# EAGLE design v1 (EAGLE 9.5.2)
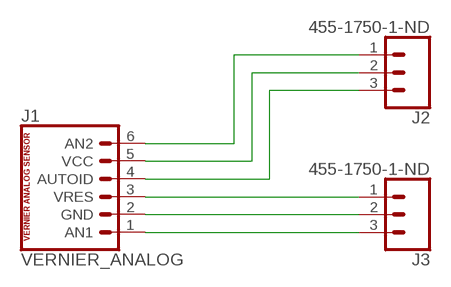
[diagram p0: schematic, sheet 1]

## Parts
J1  VERNIER_ANALOG  [BTA]
J2  455-1750-1-ND  CONN_03  [1X03]
J3  455-1750-1-ND  CONN_03  [1X03]

## Nets
N$1: J1.1(AN1) J3.3
N$2: J1.2(GND) J3.2
N$3: J1.3(VRES) J3.1
N$4: J1.4(AUTOID) J2.3
N$5: J1.5(VCC) J2.2
N$6: J1.6(AN2) J2.1

## Library data of the parts
J1 = SparkFun-Connectors:VERNIER_ANALOG: British Telecom Connector - BTA (female) This device is useful when designing a project that uses any of the analog sensors in the Vernier ecosystem (sensors and/or controllers) SparkFun Products: SparkFun Vernier Interface Shield <https://www.sparkfun.com/products/12858> (DEV-12858) British Telecom Connector - BTA (female) <https://www.sparkfun.com/products/12753>; PROD_ID: CONN-11653; SF_ID: PRT-12753
J2 J3 = SparkFun-Connectors:CONN_03: Multi connection point. Often used as Generic Header-pin footprint for 0.1 inch spaced/style header connections On any of the 0.1 inch spaced packages, you can populate with these: Break Away Headers - Straight <https://www.sparkfun.com/products/116> (PRT-00116) Break Away Male Headers - Right Angle <https://www.sparkfun.com/products/553> (PRT-00553) Female Headers <https://www.sparkfun.com/products/115> (PRT-00115) Break Away Headers - Machine Pin <https://www.sparkfun.com/products/117> (PRT-00117) Break Away Female Headers - Swiss Machine Pin <https://www.sparkfun.com/products/743> (PRT-00743) Stackable Header - 3 Pin (Female, 0.1") <https://www.sparkfun.com/products/13875> (PRT-13875) For SCREWTERMINALS and SPRING TERMINALS visit here: Screw Terimnals on SparkFun.com <https://www.sparkfun.com/search/results?term=Screw+Terminals> (5mm/3.5mm/2.54mm spacing) This device is also useful as a general connection point to wire up your design to another part of your project. Our various solder wires solder well into these plated through hole pads. Hook-Up Wire - Assortment (Stranded, 22 AWG) <https://www.sparkfun.com/products/11375> (PRT-11375) Hook-Up Wire - Assortment (Solid Core, 22 AWG) <https://www.sparkfun.com/products/11367> (PRT-11367) View the entire wire category on our website here <https://www.sparkfun.com/categories/141> Special notes: Molex polarized connector foot print use with SKU : PRT-08232 with associated crimp pins and housings.; PROD_ID: XXX-00000

## Board
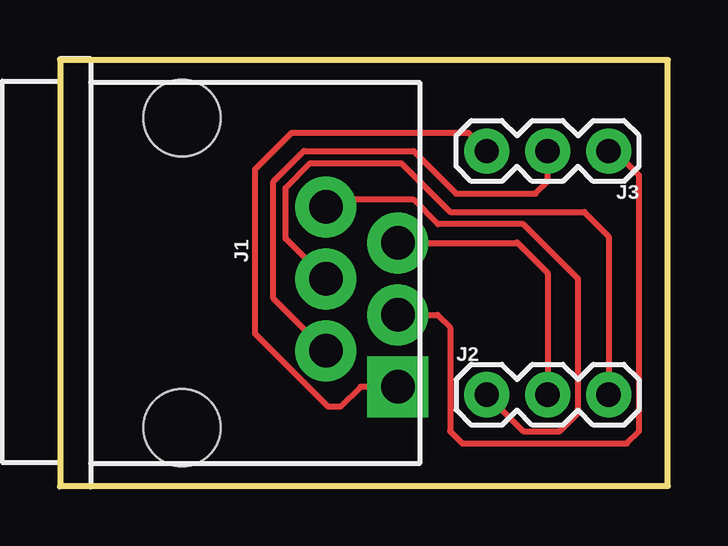
[diagram p1: board, top side]

Size 25.32 x 17.77 mm. Coordinates in mm from the lower left corner, seen from the top.
Outline: 0,0 25.32,0 25.32,17.77 0,17.77 0,0
Copper layers (1*16): Top 0.035mm / dielectric 1.5mm / Bottom 0.035mm
Design rules "default": minimum track width 6mil, minimum drill 0.35mm, track to track 6mil, track to pad 6mil, pad to pad 6mil, via to via 6mil, smd to smd 6mil, copper to edge 40mil, drill to drill 6mil, minimum pad ring 10mil, minimum via ring 8mil, stop-mask expansion 4mil, vias tented up to drill 0mil, thermal gap 10mil

### Footprints (pad centres in the part's own frame; a part is rotated, then mirrored left to right if it is on the bottom)
BTA = drill 1.4 pad 2.54 square: 1 4.75,9 | drill 1.4 pad 2.54: 2 3.25,6; 3 1.75,9; 4 0.25,6; 5 -1.25,9; 6 -2.75,6 | hole 3.2: 6.45,0; -6.45,0
1X03 = drill 1.016 pad 1.88: 1 0,0; 2 2.54,0; 3 5.08,0

### Placement (x,y rotation side)
J1  5.08,8.89 270 top
J2  17.78,3.81 0 top
J3  22.86,13.97 180 top

### Tracks (layer width: path | path; a pad name or v marks a point on that pad's centre or on a via)
N$1
  Top 0.254: J1.1 12.52,4.14 11.68,3.3 11.18,3.3 8.13,6.35 8.13,13.21 9.65,14.73 17.02,14.73 J3.3
N$2
  Top 0.254: J1.2 8.89,7.83 8.89,12.7 10.16,13.97 14.73,13.97 16.51,12.19 19.81,12.19 20.32,12.7 J3.2
N$3
  Top 0.254: J1.3 15.72,7.14 16.26,6.6 16.26,2.29 16.76,1.78 23.62,1.78 24.13,2.29 24.13,12.95 23.11,13.97 J3.1
N$4
  Top 0.254: J1.4 9.4,10.32 9.4,12.45 10.41,13.46 14.22,13.46 16.26,11.43 21.84,11.43 22.86,10.41 J2.3
N$5
  Top 0.254: J1.5 19.03,10.14 19.05,10.16 20.32,8.89 J2.2
N$6
  Top 0.254: J2.1 19.3,2.29 20.83,2.29 21.59,3.05 21.59,8.64 19.3,10.92 15.75,10.92 14.73,11.94 11.38,11.94 J1.6